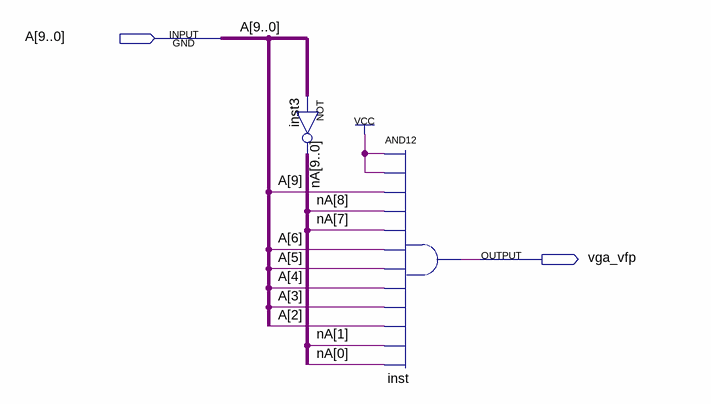
[diagram p0: schematic sheet]
// Quartus schematic vga_vsp.bdf as structural Verilog: 2 symbols, 2 pins
module vga_vsp (
  input  [9:0] A,
  output vga_vfp
);

  wire [9:0] nA;

  assign nA = ~A;  // NOT inst3, 10 bits wide
  and inst (vga_vfp, 1'b1, 1'b1, A[9], nA[8], nA[7], A[6], A[5], A[4], A[3], A[2], nA[1], nA[0]);
endmodule
